# EAGLE schematic DX-HR (EAGLE 6.6.0)
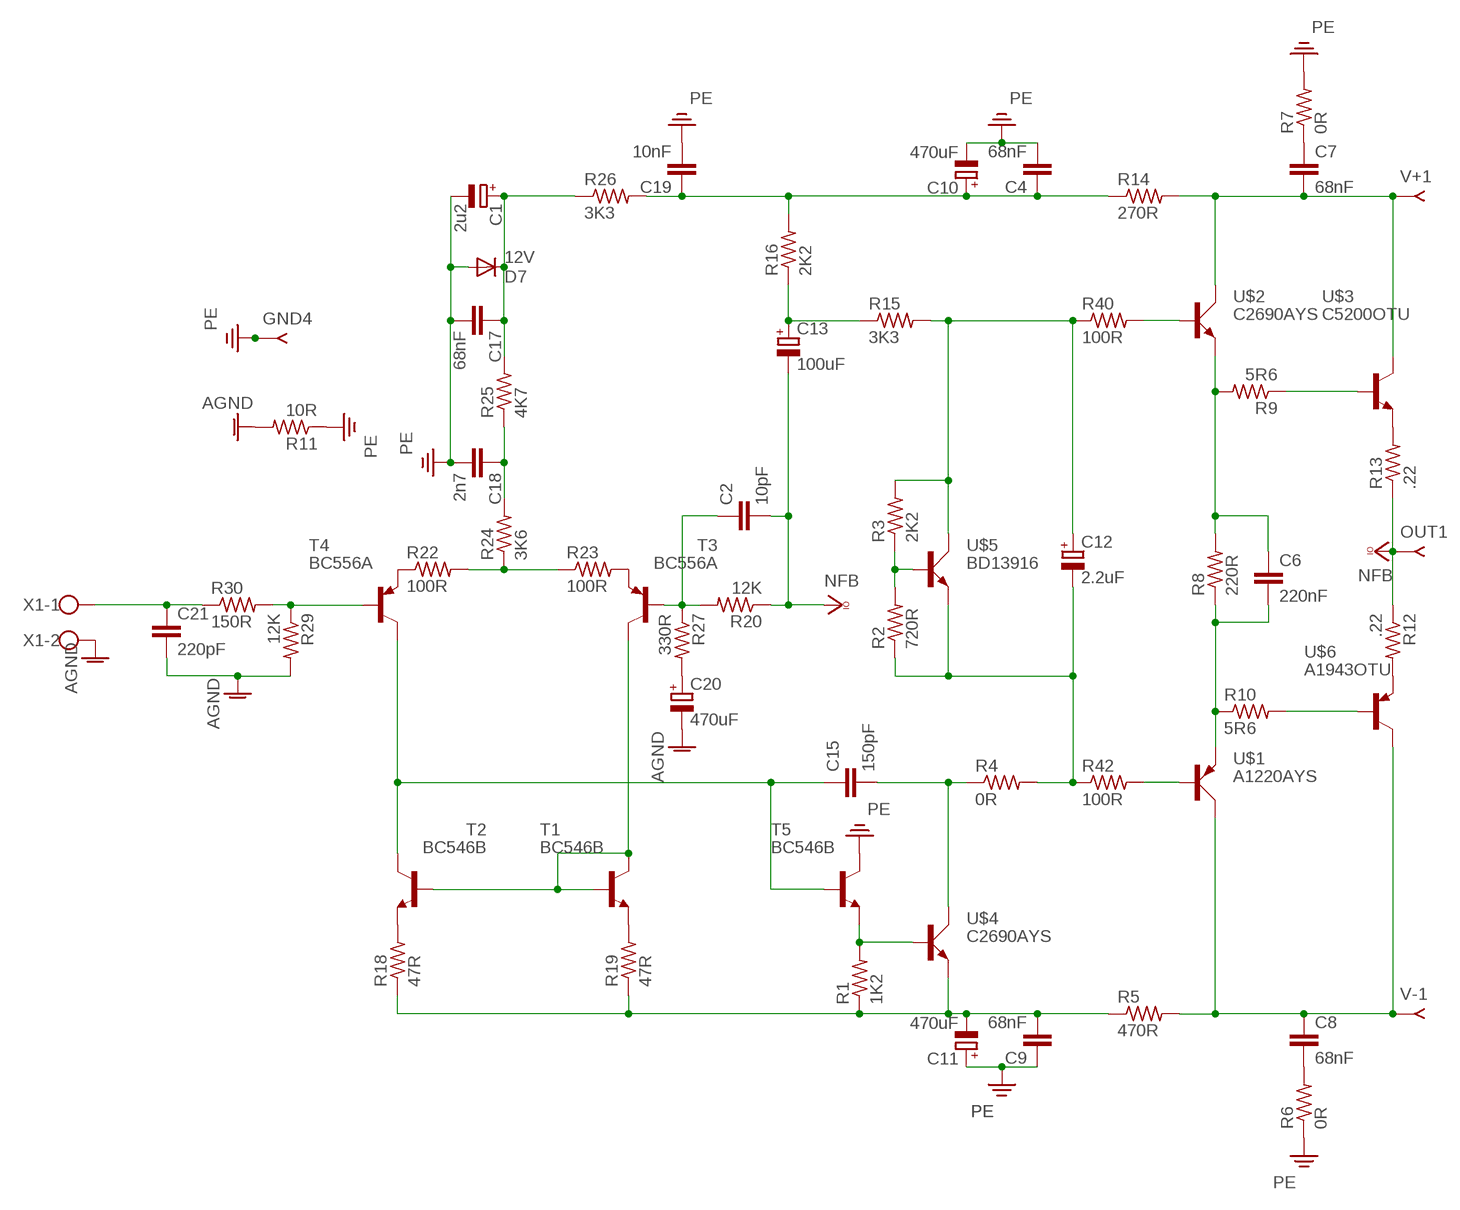
[diagram p0: schematic, sheet 1]

## Parts
C1  2u2  CPOL-EUE3.5-8  [E3,5-8]
C2  10pF  C-EU102-043X133  [C102-043X133]
C4  68nF  C-EU050-055X075  [C050-055X075]
C6  220nF  C-EU102-043X133  [C102-043X133]
C7  68nF  C-EU102-043X133  [C102-043X133]
C8  68nF  C-EU102-043X133  [C102-043X133]
C9  68nF  C-EU050-055X075  [C050-055X075]
C10  470uF  CPOL-EUE5-13  [E5-13]
C11  470uF  CPOL-EUE5-13  [E5-13]
C12  2.2uF  CPOL-EUE3.5-8  [E3,5-8]
C13  100uF  CPOL-EUE5-10.5  [E5-10,5]
C15  150pF  C-EU102-043X133  [C102-043X133]
C17  68nF  C-EU050-035X075  [C050-035X075]
C18  2n7  C-EU050-055X075  [C050-055X075]
C19  10nF  C-EU050-055X075  [C050-055X075]
C20  470uF  CPOL-EUE5-10.5  [E5-10,5]
C21  220pF  C-EU050-055X075  [C050-055X075]
D7  12V  1N4004  [DO41-10]
GND4  GND  QFIT  [FASTON]
OUT1  QFIT  [FASTON]
R1  1K2  R-US_0309/12  [0309/12]
R2  720R  R-US_0309/12  [0309/12]
R3  2K2  R-US_0309/10  [0309/10]
R4  0R  R-US_0309/12  [0309/12]
R5  470R  R-US_0617/22  [0617/22]
R6  0R  R-US_0309/12  [0309/12]
R7  0R  R-US_0309/12  [0309/12]
R8  220R  R-US_0309/12  [0309/12]
R9  5R6  R-US_0309/12  [0309/12]
R10  5R6  R-US_0309/12  [0309/12]
R11  10R  R-US_0309/12  [0309/12]
R12  .22  R-US_0617/22  [0617/22]
R13  .22  R-US_0617/22  [0617/22]
R14  270R  R-US_0617/22  [0617/22]
R15  3K3  R-US_0309/12  [0309/12]
R16  2K2  R-US_0309/12  [0309/12]
R18  47R  R-US_0309/12  [0309/12]
R19  47R  R-US_0309/12  [0309/12]
R20  12K  R-US_0309/12  [0309/12]
R22  100R  R-US_0309/12  [0309/12]
R23  100R  R-US_0309/12  [0309/12]
R24  3K6  R-US_0309/12  [0309/12]
R25  4K7  R-US_0309/12  [0309/12]
R26  3K3  R-US_0309/12  [0309/12]
R27  330R  R-US_0309/12  [0309/12]
R29  12K  R-US_0309/12  [0309/12]
R30  150R  R-US_0309/12  [0309/12]
R40  100R  R-US_0309/10  [0309/10]
R42  100R  R-US_0309/10  [0309/10]
T1  BC546B  -NPN-TO92-CBE  [TO92-CBE]
T2  BC546B  -NPN-TO92-CBE  [TO92-CBE]
T3  BC556A  -PNP-TO92-CBE  [TO92-CBE]
T4  BC556A  -PNP-TO92-CBE  [TO92-CBE]
T5  BC546B  -NPN-TO92-CBE  [TO92-CBE]
U$1  A1220AYS  TIP42C  [TO220AV]
U$2  C2690AYS  TIP41C  [TO220AV]
U$3  C5200OTU  MJL4281  [TO-264]
U$4  C2690AYS  TIP41C  [TO220AV]
U$5  BD13916  TIP41C  [TO220AV]
U$6  A1943OTU  MJL4302  [TO-264]
V+1  QFIT  [FASTON]
V-1  QFIT  [FASTON]
X1  W237-02P  [W237-132]

## Nets
AGND: C20.- C21.2 R11.2 R29.2 X1.2
N$1: R1.2 T5.E U$4.B
N$2: R2.2 R3.1 U$5.B
N$3: C8.2 R6.2
N$4: C12.+ R3.2 R15.2 R40.1 U$5.C
N$5: R40.2 U$2.B
N$6: C7.2 R14.2 U$2.C U$3.C V+1.1 V+1.2
N$7: C12.- R2.1 R4.2 R42.1 U$5.E
N$8: C15.2 R4.1 U$4.C
N$9: R42.2 U$1.B
N$10: C6.2 R8.1 R10.1 U$1.E
N$11: C7.1 R7.1
N$12: C6.1 R8.2 R9.2 U$2.E
N$16: C8.1 R5.2 U$1.C U$6.C V-1.1 V-1.2
N$17: R9.1 U$3.B
N$20: R10.2 U$6.B
N$21: C9.2 C11.- R1.1 R5.1 R18.1 R19.1 U$4.E
N$22: R12.2 U$6.E
N$24: R13.2 U$3.E
N$25: C4.1 C10.+ C19.1 R14.1 R16.2 R26.2
N$28: R29.1 R30.2 T4.B
N$30: C21.1 R30.1 X1.1
N$31: C13.+ R15.1 R16.1
N$34: C2.1 R20.2 R27.1 T3.B
N$35: R18.2 T2.E
N$36: T1.B T1.C T2.B T3.C
N$37: R22.1 T4.E
N$38: C15.1 T2.C T4.C T5.B
N$39: R19.2 T1.E
N$40: R23.2 T3.E
N$41: R22.2 R23.1 R24.1
N$42: C18.1 R24.2 R25.1
N$43: C1.+ C17.1 D7.C R25.2 R26.1
N$46: C20.+ R27.2
PE: C1.- C4.2 C9.1 C10.- C11.+ C17.2 C18.2 C19.2 D7.A GND4.1 GND4.2 R6.1 R7.2 R11.1 T5.C
VCCIO: C2.2 C13.- OUT1.1 OUT1.2 R12.1 R13.1 R20.1 ; supply symbol labelled NFB

## Library data of the parts
C1 C10-C13 C20 = resistor:CPOL-EU: POLARIZED CAPACITOR, European symbol
C2 C4 C6-C9 C15 C17-C19 C21 = resistor:C-EU: CAPACITOR, European symbol
D7 = diode:1N4004: DIODE general purpose rectifier, 1 A
GND4 OUT1 V+1 V-1 = keystone:QFIT: QUICKFIT PCB TERMINAL
R1-R16 R18-R20 R22-R27 R29 R30 R40 R42 = resistor:R-US_: RESISTOR, American symbol
T1 T2 T5 = transistor-neu-to92:*-NPN-: NPN Transistror
T3 T4 = transistor-neu-to92:*-PNP-: PNP Transistror
U$1 = transistor-power:TIP42C: PNP TRANSISTOR
U$2 U$4 U$5 = transistor-power:TIP41C: NPN TRANSISTOR
U$3 = Rudi_TO264:MJL4281: MJL4281 NPN BCE TO-264
U$6 = Rudi_TO264:MJL4302: MJL4302 PNP BCE TO-264
X1 = con-wago-508:W237-02P: WAGO SREW CLAMP